# Altium schematic sheet Block Diagram.SchDoc
size A4; DocumentNumber: 1; SheetNumber: 1
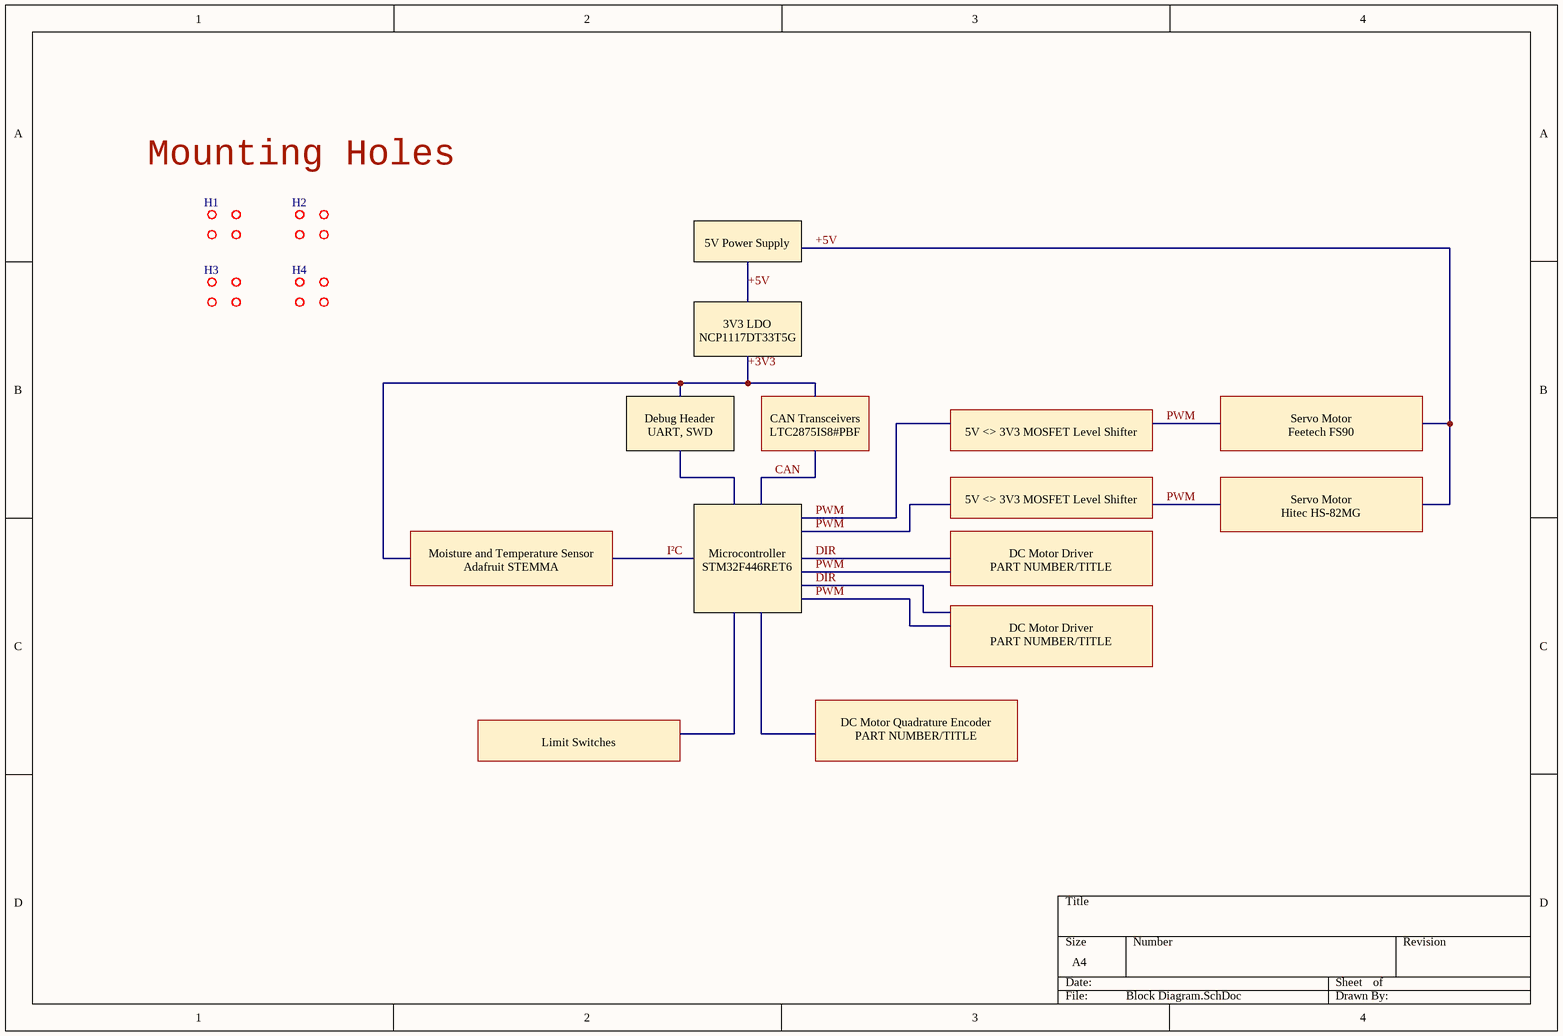
[diagram p0: Block Diagram.SchDoc]

## Parts
H1  MOUNTING_HOLES  [MOUNTING_HOLE]  (value not drawn)
H2  MOUNTING_HOLES  [MOUNTING_HOLE]  (value not drawn)
H3  MOUNTING_HOLES  [MOUNTING_HOLE]  (value not drawn)
H4  MOUNTING_HOLES  [MOUNTING_HOLE]  (value not drawn)

## Notes on the sheet
- Mounting Holes
- 5V Power Supply
- 3V3 LDO
  NCP1117DT33T5G
- Debug Header
  UART, SWD
- CAN Transceivers
  LTC2875IS8#PBF
- 5V <> 3V3 MOSFET Level Shifter
- Servo Motor
  Feetech FS90
- Moisture and Temperature Sensor
  Adafruit STEMMA
- DC Motor Driver
  PART NUMBER/TITLE
- Servo Motor
  Hitec HS-82MG
- Microcontroller
  STM32F446RET6
- Limit Switches
- DC Motor Quadrature Encoder
  PART NUMBER/TITLE

## Library data of the parts
H1-H4 = MOUNTING_HOLES: 6cm x 6cm